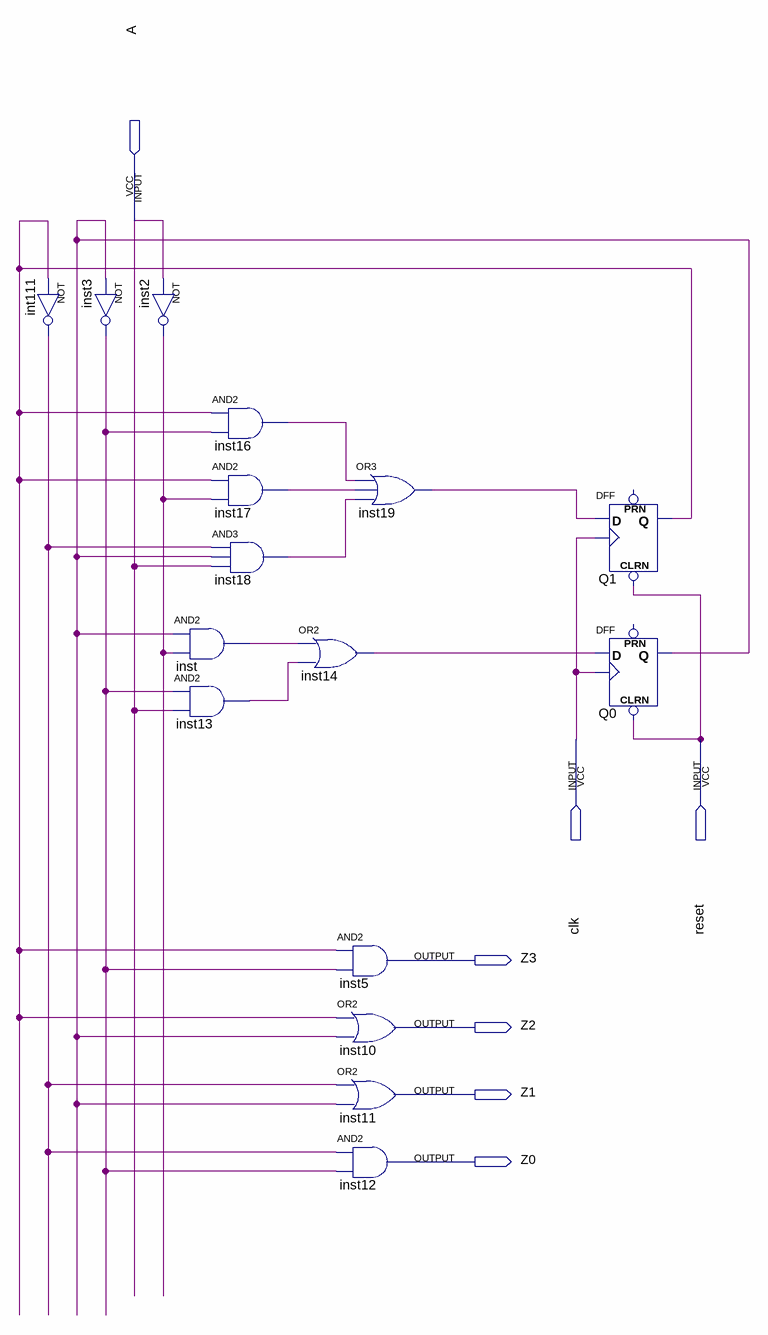
[diagram p0: schematic sheet]
// Quartus schematic MrBeansStateMachine.bdf as structural Verilog: 16 symbols, 7 pins
module MrBeansStateMachine (
  input  A,
  input  clk,
  input  reset,
  output Z3,
  output Z2,
  output Z1,
  output Z0
);

  wire inst2_out, inst3_out, inst13_out, inst14_out, inst16_out, inst17_out, inst18_out, inst19_out,
       inst_out, int111_out, Q0_q, Q1_q;

  not int111 (int111_out, Q1_q);
  not inst3 (inst3_out, Q0_q);
  not inst2 (inst2_out, A);
  and inst (inst_out, Q0_q, inst2_out);
  and inst13 (inst13_out, inst3_out, A);
  and inst16 (inst16_out, Q1_q, inst3_out);
  and inst17 (inst17_out, Q1_q, inst2_out);
  and inst18 (inst18_out, int111_out, Q0_q, A);
  or inst14 (inst14_out, inst_out, inst13_out);
  and inst5 (Z3, Q1_q, inst3_out);
  or inst10 (Z2, Q1_q, Q0_q);
  or inst11 (Z1, int111_out, Q0_q);
  and inst12 (Z0, int111_out, inst3_out);
  or inst19 (inst19_out, inst16_out, inst17_out, inst18_out);
  DFF Q1 (.CLRN(reset), .CLK(clk), .D(inst19_out), .Q(Q1_q));  // open: PRN
  DFF Q0 (.CLRN(reset), .CLK(clk), .D(inst14_out), .Q(Q0_q));  // open: PRN
endmodule
